# Altium schematic sheet Master Schematic Sheet.SchDoc
size A4
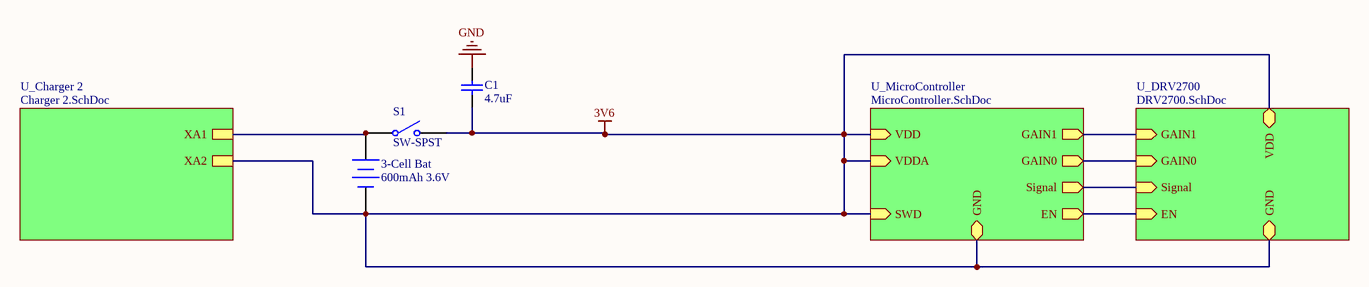
[diagram p0: Master Schematic Sheet.SchDoc]

## Parts
3-Cell_Bat  600mAh 3.6V
C1  value 4.7uF  [RAD-0.3]  (hidden comment: Cap)
S1  SW-SPST  [SPST-2]

## Sub-sheets
U_Charger 2 = Charger 2.SchDoc: XA1, XA2
U_DRV2700 = DRV2700.SchDoc: EN (in), GAIN0 (in), GAIN1 (in), Signal (in), VDD, GND
U_MicroController = MicroController.SchDoc: GAIN1 (out), GAIN0 (out), Signal (out), EN (out), VDD (in), VDDA (in), GND, SWD (in)

## Nets
3V6: 3-Cell_Bat.2(-) C1.2 S1.2(NO) ; sheet U_Charger 2/XA2, sheet U_MicroController/VDD, sheet U_MicroController/VDDA, sheet U_MicroController/GND, sheet U_MicroController/SWD, sheet U_DRV2700/VDD, sheet U_DRV2700/GND
GND: C1.1
Net3-Cell_Bat_1: 3-Cell_Bat.1(+) S1.1(COMMON) ; sheet U_Charger 2/XA1
(unnamed): sheet U_MicroController/GAIN1, sheet U_DRV2700/GAIN1
(unnamed): sheet U_MicroController/GAIN0, sheet U_DRV2700/GAIN0
(unnamed): sheet U_MicroController/Signal, sheet U_DRV2700/Signal
(unnamed): sheet U_MicroController/EN, sheet U_DRV2700/EN

## Library data of the parts
3-Cell_Bat = Battery: Multicell Battery; Published: 24-Mar-1999; LatestRevisionDate: 17-Jul-2002; LatestRevisionNote: Re-released for DXP Platform.; PackageReference: BAT-2; Publisher: Altium Limited; PackageDescription: Battery; 2 Leads
C1 = Cap: Capacitor; Published: 8-Jun-2000; LatestRevisionDate: 17-Jul-2002; LatestRevisionNote: Re-released for DXP Platform.; PackageReference: RAD-0.3; Publisher: Altium Limited; PackageDescription: Radial Cap, Thru-Hole; 2 Leads; 0.3 in Pin Spacing
S1 = SW-SPST: Single-Pole, Single-Throw Switch; Published: 24-Mar-1999; LatestRevisionDate: 17-Jul-2002; LatestRevisionNote: Re-released for DXP Platform.; PackageReference: SPST-2; Publisher: Altium Limited; PackageDescription: Switch; 2 Leads